# Altium schematic sheet Sheet_all.SchDoc
size A4
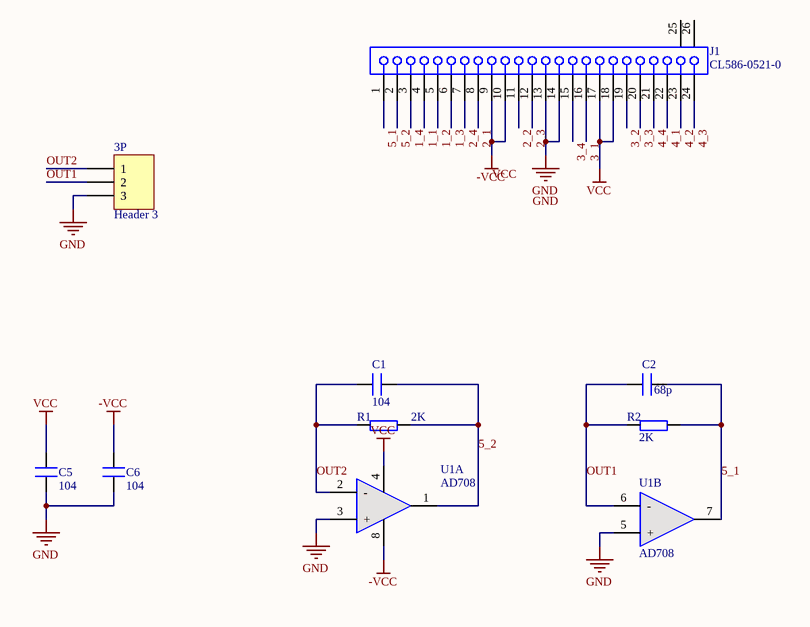
[diagram p0: Sheet_all.SchDoc]

## Parts
3P  Header 3  [Header-1*3-2.54mm]
C1  104  [0603P]
C2  68p  [0603P]
C5  104  [0603P]
C6  104  [0603P]
J1  CL586-0521-0  [FH12-24S-0.5SH]
R1  2K  [0603P]
R2  2K  [0603P]
U1  AD708  [NSO8_N]  (parts A,B of 2)

## Nets
-VCC: C6.2 J1.9 J1.10 U1.8(V+)
GND: 3P.3 C5.1 C6.1 J1.13 J1.14 U1.3(+) U1.5(+)
VCC: C5.2 J1.17 J1.18 U1.4(V-)
1_1: J1.4
1_2: J1.5
1_3: J1.6
1_4: J1.3
2_1: J1.8
2_2: J1.11
2_3: J1.12
2_4: J1.7
3_1: J1.16
3_2: J1.19
3_3: J1.20
3_4: J1.15
4_1: J1.22
4_2: J1.23
4_3: J1.24
4_4: J1.21
5_1: C2.2 J1.1 R2.2 U1.7(OUT2)
5_2: C1.2 J1.2 R1.2 U1.1(OUT1)
OUT1: 3P.2 C2.1 R2.1 U1.6(-)
OUT2: 3P.1 C1.1 R1.1 U1.2(-)

Not connected (* = marked no-connect by the designer): J1 25(MH1) 26(MH2)

## Notes on the sheet
- Labels drawn without touching a wire or pin: GND, VCC

## Library data of the parts
3P = Header 3: Header, 3-Pin; LatestRevisionDate: 17-Jul-2002; LatestRevisionNote: Re-released for DXP Platform.; Publisher: Altium Limited
C1 C2 C5 C6 = C
J1 = CL586-0521-0: FH12 Series, "Flip-Lock" SMT/ZIF Connector - 0.5mm Spaced Bottom Contact; Positions: 24; ContactMaterial: Phosphor Bronze; Current: 0.4A; PCB_Layout: Complies with manufacturer's recommendation.; Published: 17-Jul-2002; DatasheetDocument: 13-Nov-2000; PackageDocument: 13-Nov-2000; PackageReference: FH12-24S-0.5SH; Publisher: Altium Limited; PadDimensions: Follow nominal values, Suitable for Wave Soldering, Adjust for Re-flow.; ComponentLink1Description: Manufacturer Link; ComponentLink1URL: http://www.hiroseusa.com/; ComponentLink2Description: Datasheet; ComponentLink2URL: http://www.hirose.co.jp/cataloge_hp/e58605370.pdf
R1 R2 = R
U1 = LM358: 双运放